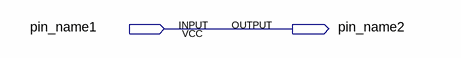
[diagram p0: schematic sheet]
// Quartus schematic elevator_control.bdf as structural Verilog: 0 symbols, 2 pins
module elevator_control (
  input  pin_name1,
  output pin_name2
);


  assign pin_name2 = pin_name1;
endmodule
